# EAGLE design tick-shield-mk-1 (EAGLE 6.5.0)
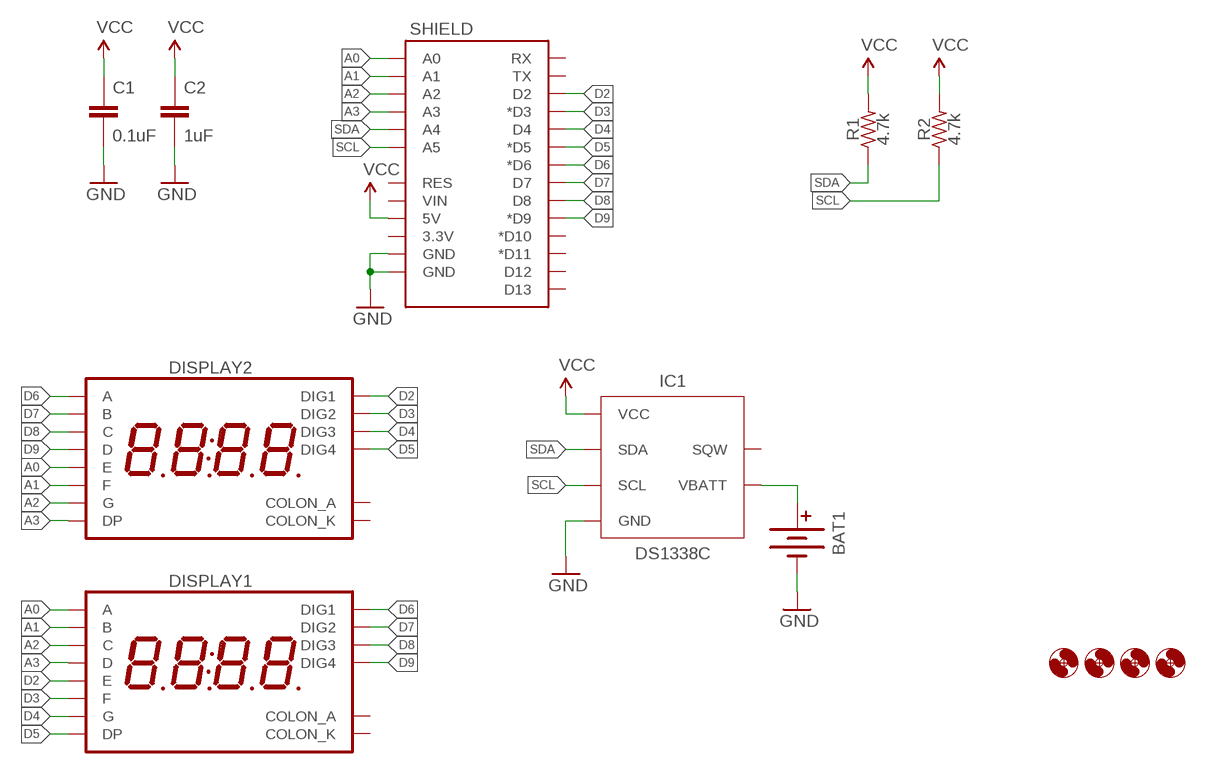
[diagram p0: schematic, sheet 1]

## Parts
BAT1  BATTERY12MM  [BATTCON_12MM]
C1  0.1uF  CAPACITOR-CERAMICC0603  [C0603]
C2  1uF  CAPACITOR-CERAMICC0805  [C0805]
DISPLAY1  7SEG_4DIGIT_COLON14.2MM-CC  [7SEG_4DIG_0.56IN_14MM_ADAFRUIT]
DISPLAY2  7SEG_4DIGIT_COLON14.2MM-CC  [7SEG_4DIG_0.56IN_14MM_ADAFRUIT]
H1  HOLE#2  [HOLE-#2]
H2  HOLE#2  [HOLE-#2]
H3  HOLE#2  [HOLE-#2]
H4  HOLE#2  [HOLE-#2]
IC1  DS1338C  DS1338CSOIC16W  [SO16W]
R1  4.7k  RESISTORR0603  [R0603]
R2  4.7k  RESISTORR0603  [R0603]
SHIELD  ARDUINO_SHIELD_SMALLER  [ARDUINO_SHIELD_NOOUTLINE_INSIDE_SMALLER]

## Nets
A0: DISPLAY1.P$13(A) DISPLAY2.P$1(E) SHIELD.A0
A1: DISPLAY1.P$9(B) DISPLAY2.P$12(F) SHIELD.A1
A2: DISPLAY1.P$4(C) DISPLAY2.P$5(G) SHIELD.A2
A3: DISPLAY1.P$2(D) DISPLAY2.P$3(DP) SHIELD.A3
D2: DISPLAY1.P$1(E) DISPLAY2.P$14(DIG1) SHIELD.D2
D3: DISPLAY1.P$12(F) DISPLAY2.P$11(DIG2) SHIELD.D3(*D3)
D4: DISPLAY1.P$5(G) DISPLAY2.P$10(DIG3) SHIELD.D4
D5: DISPLAY1.P$3(DP) DISPLAY2.P$6(DIG4) SHIELD.D5(*D5)
D6: DISPLAY1.P$14(DIG1) DISPLAY2.P$13(A) SHIELD.D6(*D6)
D7: DISPLAY1.P$11(DIG2) DISPLAY2.P$9(B) SHIELD.D7
D8: DISPLAY1.P$10(DIG3) DISPLAY2.P$4(C) SHIELD.D8
D9: DISPLAY1.P$6(DIG4) DISPLAY2.P$2(D) SHIELD.D9(*D9)
GND: BAT1.GND(-) C1.2 C2.2 IC1.4(GND) IC1.5(GND) IC1.6(GND) IC1.7(GND) IC1.8(GND) IC1.9(GND) IC1.10(GND) IC1.11(GND) IC1.12(GND) IC1.13(GND) IC1.15(GND) SHIELD.GND@0(GND) SHIELD.GND@1(GND)
N$3: BAT1.PWR@1(+) IC1.14(VBATT)
SCL: IC1.1(SCL) R2.1 SHIELD.A5
SDA: IC1.16(SDA) R1.1 SHIELD.A4
VCC: C1.1 C2.1 IC1.3(VCC) R1.2 R2.2 SHIELD.5V
Unconnected: DISPLAY1.P$7(COLON_K) DISPLAY1.P$8(COLON_A) DISPLAY2.P$7(COLON_K) DISPLAY2.P$8(COLON_A) IC1.2(SQW) SHIELD.3.3V SHIELD.D10(*D10) SHIELD.D11(*D11) SHIELD.D12 SHIELD.D13 SHIELD.RES SHIELD.RX SHIELD.TX SHIELD.VIN

## Library data of the parts
BAT1 = A_butts:BATTERY: Battery Holders Various common sizes : AA, AAA, 20mm coin cell and 12mm coin cell. 20MM_4LEGS, BATT-10373
C1 C2 = A_butts:CAPACITOR-CERAMIC: CAPACITOR, European symbol
DISPLAY1 DISPLAY2 = A_butts:7SEG_4DIGIT_COLON
H1-H4 = A_butts:HOLE: MOUNTING HOLE with drill center marker
IC1 = A_butts:DS1338C
R1 R2 = A_butts:RESISTOR: RESISTOR, American symbol
SHIELD = A_butts:ARDUINO_SHIELD_SMALLER

## Board
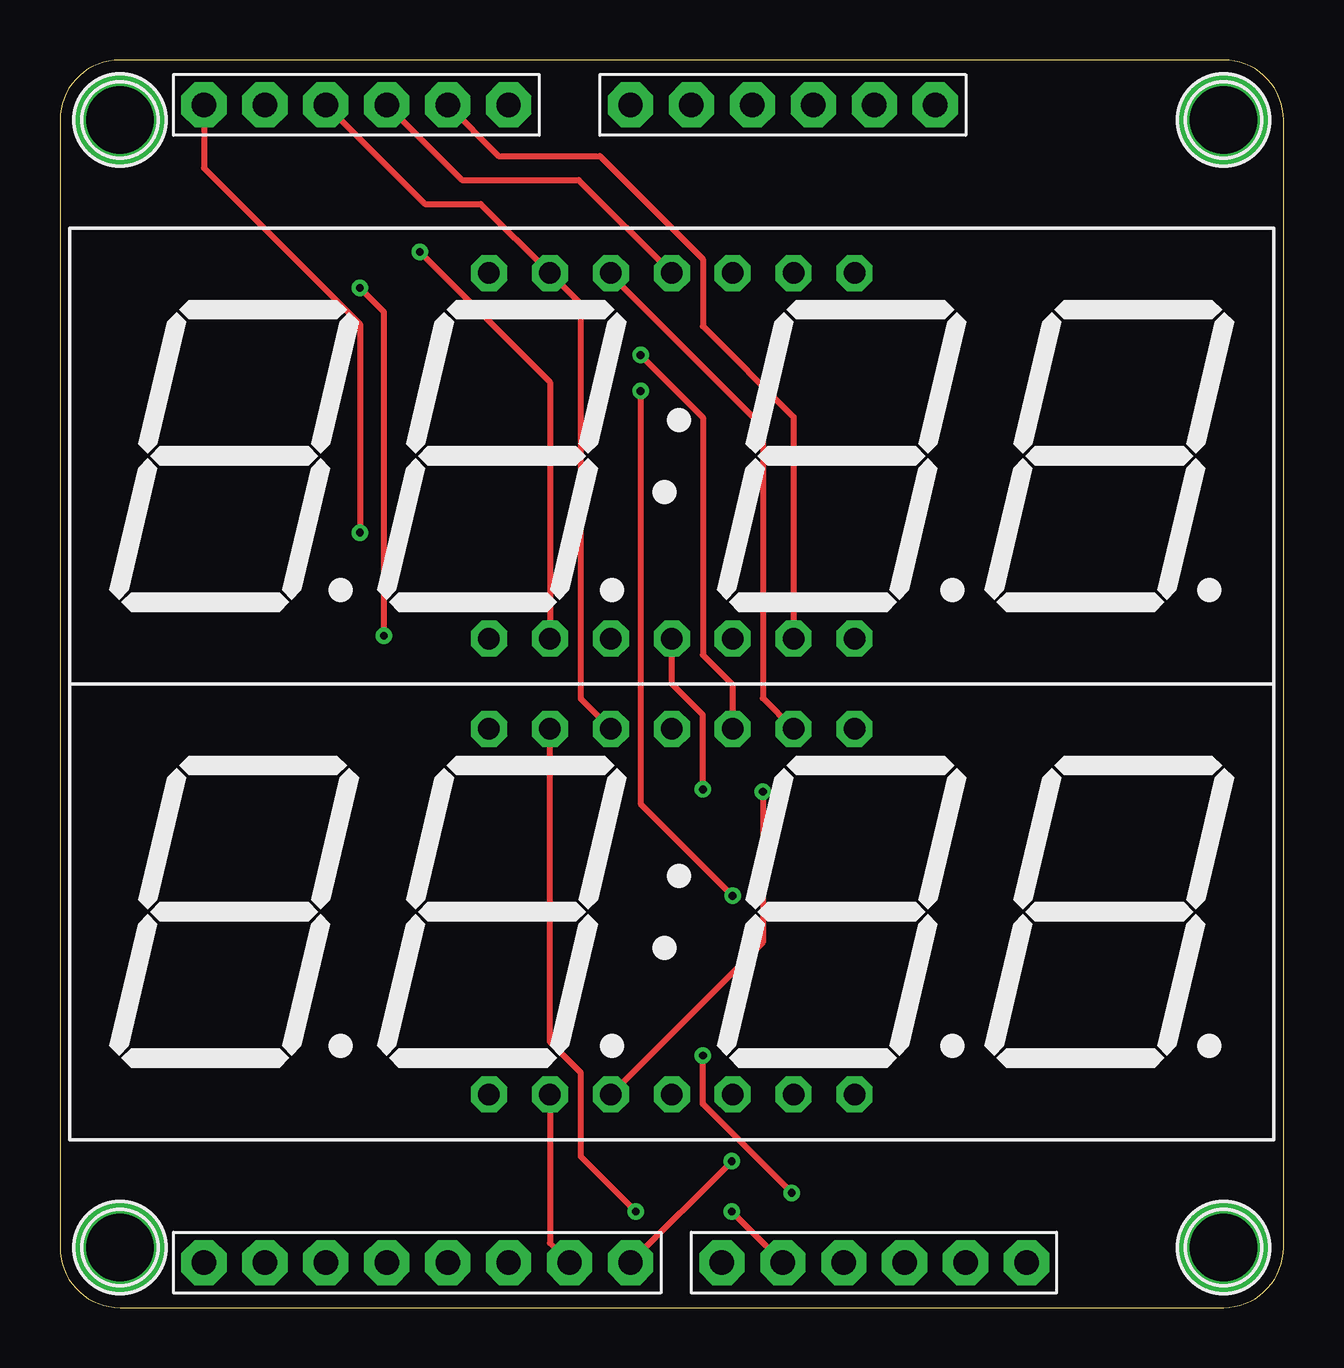
[diagram p1: board, top side]
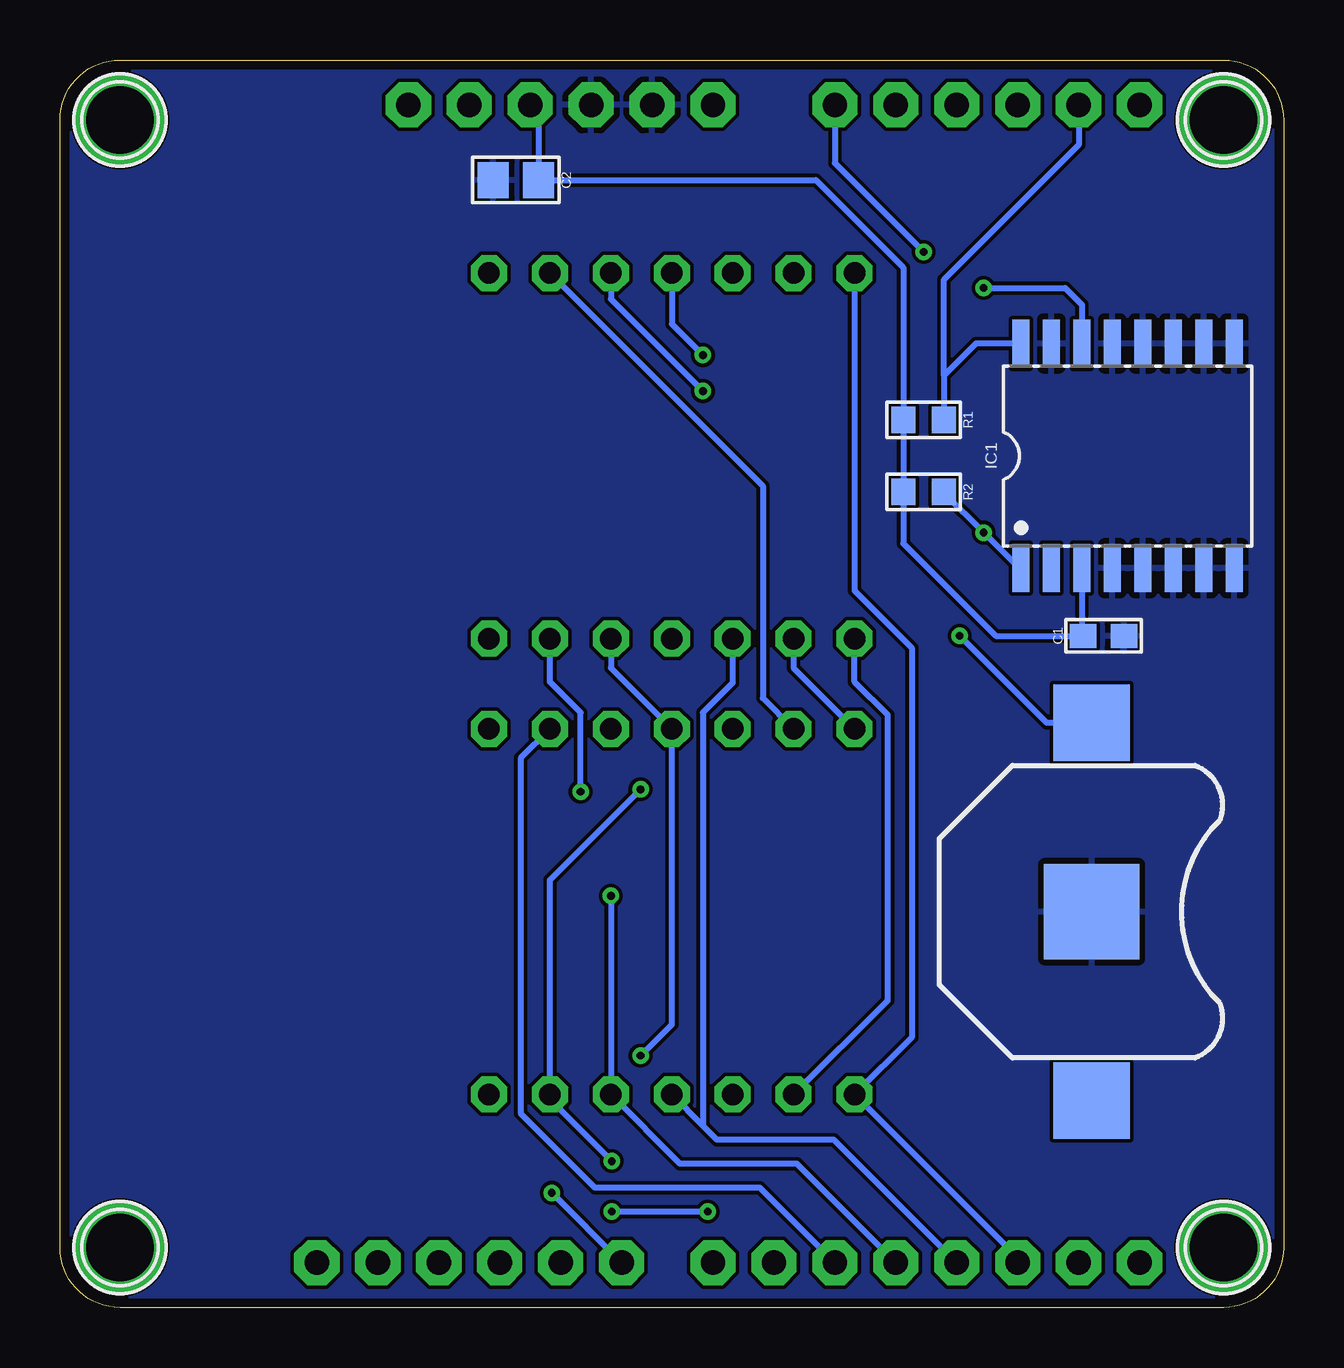
[diagram p2: board, bottom side, seen from below]

Size 51 x 52 mm. Coordinates in mm from the lower left corner, seen from the top.
Outline: 0,49.5 0,2.5 arc90 2.5,0 48.5,0 arc90 51,2.5 51,49.5 arc90 48.5,52 2.5,52 arc90 0,49.5
Copper layers (1*16): Top 0.0356mm / dielectric 1.5011mm / Bottom 0.0356mm
Design rules "LaenPCBOrder2": minimum track width 6mil, minimum drill 13mil, track to track 6mil, track to pad 6mil, pad to pad 6mil, via to via 6mil, smd to smd 6mil, copper to edge 15mil, drill to drill 6mil, minimum pad ring 7mil, minimum via ring 7mil, stop-mask expansion 3mil, vias tented up to drill 20mil, thermal gap 10mil

### Footprints (pad centres in the part's own frame; a part is rotated, then mirrored left to right if it is on the bottom)
BATTCON_12MM = smd 3.962 x 3.962: GND 0,0 | smd 3.175 x 3.175: PWR@1 -7.874,0; PWR@2 7.874,0
C0603 = smd 1.1 x 1: 1 -0.85,0; 2 0.85,0
C0805 = smd 1.3 x 1.5: 1 -0.95,0; 2 0.95,0
7SEG_4DIG_0.56IN_14MM_ADAFRUIT = drill 0.9 pad 1.5 octagon: P$1 -7.62,7.62; P$2 -5.08,7.62; P$3 -2.54,7.62; P$4 0,7.62; P$5 2.54,7.62; P$6 5.08,7.62; P$7 7.62,7.62; P$8 7.62,-7.62; P$9 5.08,-7.62; P$10 2.54,-7.62; P$11 0,-7.62; P$12 -2.54,-7.62; P$13 -5.08,-7.62; P$14 -7.62,-7.62
HOLE-#2 = drill 2.8 pad 3.81: P$1 0,0
SO16W = smd 0.7 x 2: 1 -4.445,-4.685; 2 -3.175,-4.685; 3 -1.905,-4.685; 4 -0.635,-4.685; 5 0.635,-4.685; 6 1.905,-4.685; 7 3.175,-4.685; 8 4.445,-4.685; 9 4.445,4.685; 10 3.175,4.685; 11 1.905,4.685; 12 0.635,4.685; 13 -0.635,4.685; 14 -1.905,4.685; 15 -3.175,4.685; 16 -4.445,4.685
R0603 = smd 1 x 1.1: 1 -0.85,0; 2 0.85,0
ARDUINO_SHIELD_NOOUTLINE_INSIDE_SMALLER = drill 1.016 pad 1.88 octagon: 3.3V 48.26,-27.94; 5V 48.26,-25.4; A0 48.26,-12.7; A1 48.26,-10.16; A2 48.26,-7.62; A3 48.26,-5.08; A4 48.26,-2.54; A5 48.26,0; D2 0,-5.08; D3 0,-7.62; D4 0,-10.16; D5 0,-12.7; D6 0,-15.24; D7 0,-17.78; D8 0,-21.59; D9 0,-24.13; D10 0,-26.67; D11 0,-29.21; D12 0,-31.75; D13 0,-34.29; GND@0 48.26,-22.86; GND@1 48.26,-20.32; RES 48.26,-30.48; RX 0,0; TX 0,-2.54; VIN 48.26,-17.78

### Placement (x,y rotation side)
BAT1  8,16.5 270 bottom
C1  7.5,28 0 bottom
C2  32,47 180 bottom
DISPLAY1  25.5,35.5 0 top
DISPLAY2  25.5,16.5 0 top
H1  2.5,2.5 0 top
H2  2.5,49.5 0 top
H3  48.5,2.5 0 top
H4  48.5,49.5 0 top
IC1  6.5,35.5 0 bottom
R1  15,37 180 bottom
R2  15,34 180 bottom
SHIELD  6,1.87 90 top

### Tracks (layer width: path | path; a pad name or v marks a point on that pad's centre or on a via)
A0  (via drill 0.33)
  Top 0.25: v15,44 20.42,38.58 DISPLAY1.P$13
  Bottom 0.25: SHIELD.A0 18.7,47.7 v15,44 | DISPLAY1.P$13 20.42,26.66 DISPLAY2.P$1
A1  (via drill 0.33)
  Top 0.25: SHIELD.A1 18.29,48 22.5,48 26.8,43.7 26.8,40.9 30.58,37.12 DISPLAY1.P$9 | v29.3,21.5 29.3,15.22 DISPLAY2.P$12
  Bottom 0.25: v29.3,21.5 29.3,24.8 30.58,26.08 DISPLAY1.P$9
A2  (via drill 0.33)
  Top 0.25: SHIELD.A2 16.75,47 21.62,47 DISPLAY1.P$4 | DISPLAY2.P$5 28.04,25.96 26.8,27.2 26.8,37.1 v24.2,39.7
  Bottom 0.25: DISPLAY1.P$4 25.5,41 v24.2,39.7
A3
  Top 0.25: SHIELD.A3 15.21,46 17.54,46 DISPLAY1.P$2 21.7,41.84 21.7,25.38 DISPLAY2.P$3
D2
  Bottom 0.25: DISPLAY1.P$1 17.88,29.88 15.5,27.5 15.5,11.26 DISPLAY2.P$14 11.08,2.08 SHIELD.D2
D3
  Bottom 0.25: SHIELD.D3 18.75,7 23.62,7 24.2,7.58 | DISPLAY1.P$12 22.96,26.04 24.2,24.8 24.2,7.58 | 24.2,7.58 DISPLAY2.P$11
D4  (via drill 0.33)
  Top 0.25: v24.2,38.2 24.2,21 v28.04,17.16
  Bottom 0.25: SHIELD.D4 20.29,6 25.16,6 DISPLAY2.P$10 v28.04,17.16 | DISPLAY1.P$5 28.04,42.04 v24.2,38.2
D5
  Top 0.25: DISPLAY1.P$3 22.96,43.04 29.3,36.7 29.3,25.4 DISPLAY2.P$6
  Bottom 0.25: SHIELD.D5 21.83,5 28.7,5 31.8,8.1 31.8,22.9 DISPLAY2.P$6
D6
  Top 0.25: DISPLAY2.P$13 20.42,2.69 SHIELD.D6
  Bottom 0.25: DISPLAY2.P$13 16.5,12.8 16.5,24.7 17.88,26.08 DISPLAY1.P$14
D7  (via drill 0.33)
  Top 0.25: SHIELD.D7 v28,6.1 | v26.8,21.6 26.8,24.7 25.5,26 DISPLAY1.P$11
  Bottom 0.25: v28,6.1 30.58,8.68 DISPLAY2.P$9 30.58,17.82 v26.8,21.6
D8  (via drill 0.33)
  Top 0.25: v26.8,10.5 26.8,8.48 v30.5,4.78
  Bottom 0.25: SHIELD.D8 v30.5,4.78 | v26.8,10.5 25.5,11.8 DISPLAY2.P$4 28.04,26.66 DISPLAY1.P$10
D9  (via drill 0.33)
  Top 0.25: DISPLAY2.P$2 20.42,11.08 21.7,9.8 21.7,6.3 v24,4 | v28,4 SHIELD.D9
  Bottom 0.25: DISPLAY1.P$6 21.7,34.24 21.7,25.4 DISPLAY2.P$2 | v24,4 v28,4
GND
  pour Bottom: 48.5,0 2.5,0 arc-90 0,2.5 0,49.5 arc-90 2.5,52 48.5,52 arc-90 51,49.5 51,2.5 arc-90
N$3  (via drill 0.33)
  Top 0.25: v13.5,28 13.5,41.5 v12.5,42.5
  Bottom 0.25: BAT1.PWR@1 9.87,24.37 v13.5,28 | v12.5,42.5 9.1,42.5 8.4,41.8 IC1.14
SCL  (via drill 0.33)
  Top 0.25: SHIELD.A5 6,47.5 12.5,41 v12.5,32.3
  Bottom 0.25: 10.96,30.82 IC1.1 11.02,30.82 v12.5,32.3 14.15,33.95 R2.1
SDA
  Bottom 0.25: SHIELD.A4 8.54,48.46 14.15,42.85 14.15,38.85 | 14.15,38.85 R1.1 | IC1.16 12.81,40.19 14.15,38.85
VCC
  Bottom 0.25: SHIELD.5V 31.05,49.78 C2.1 19.5,47 15.85,43.35 R1.2 R2.2 15.85,31.85 12,28 C1.1 8.4,28.05 IC1.3